# Altium project PCB_3U_DAC.PrjPCB (part 3 of 3)
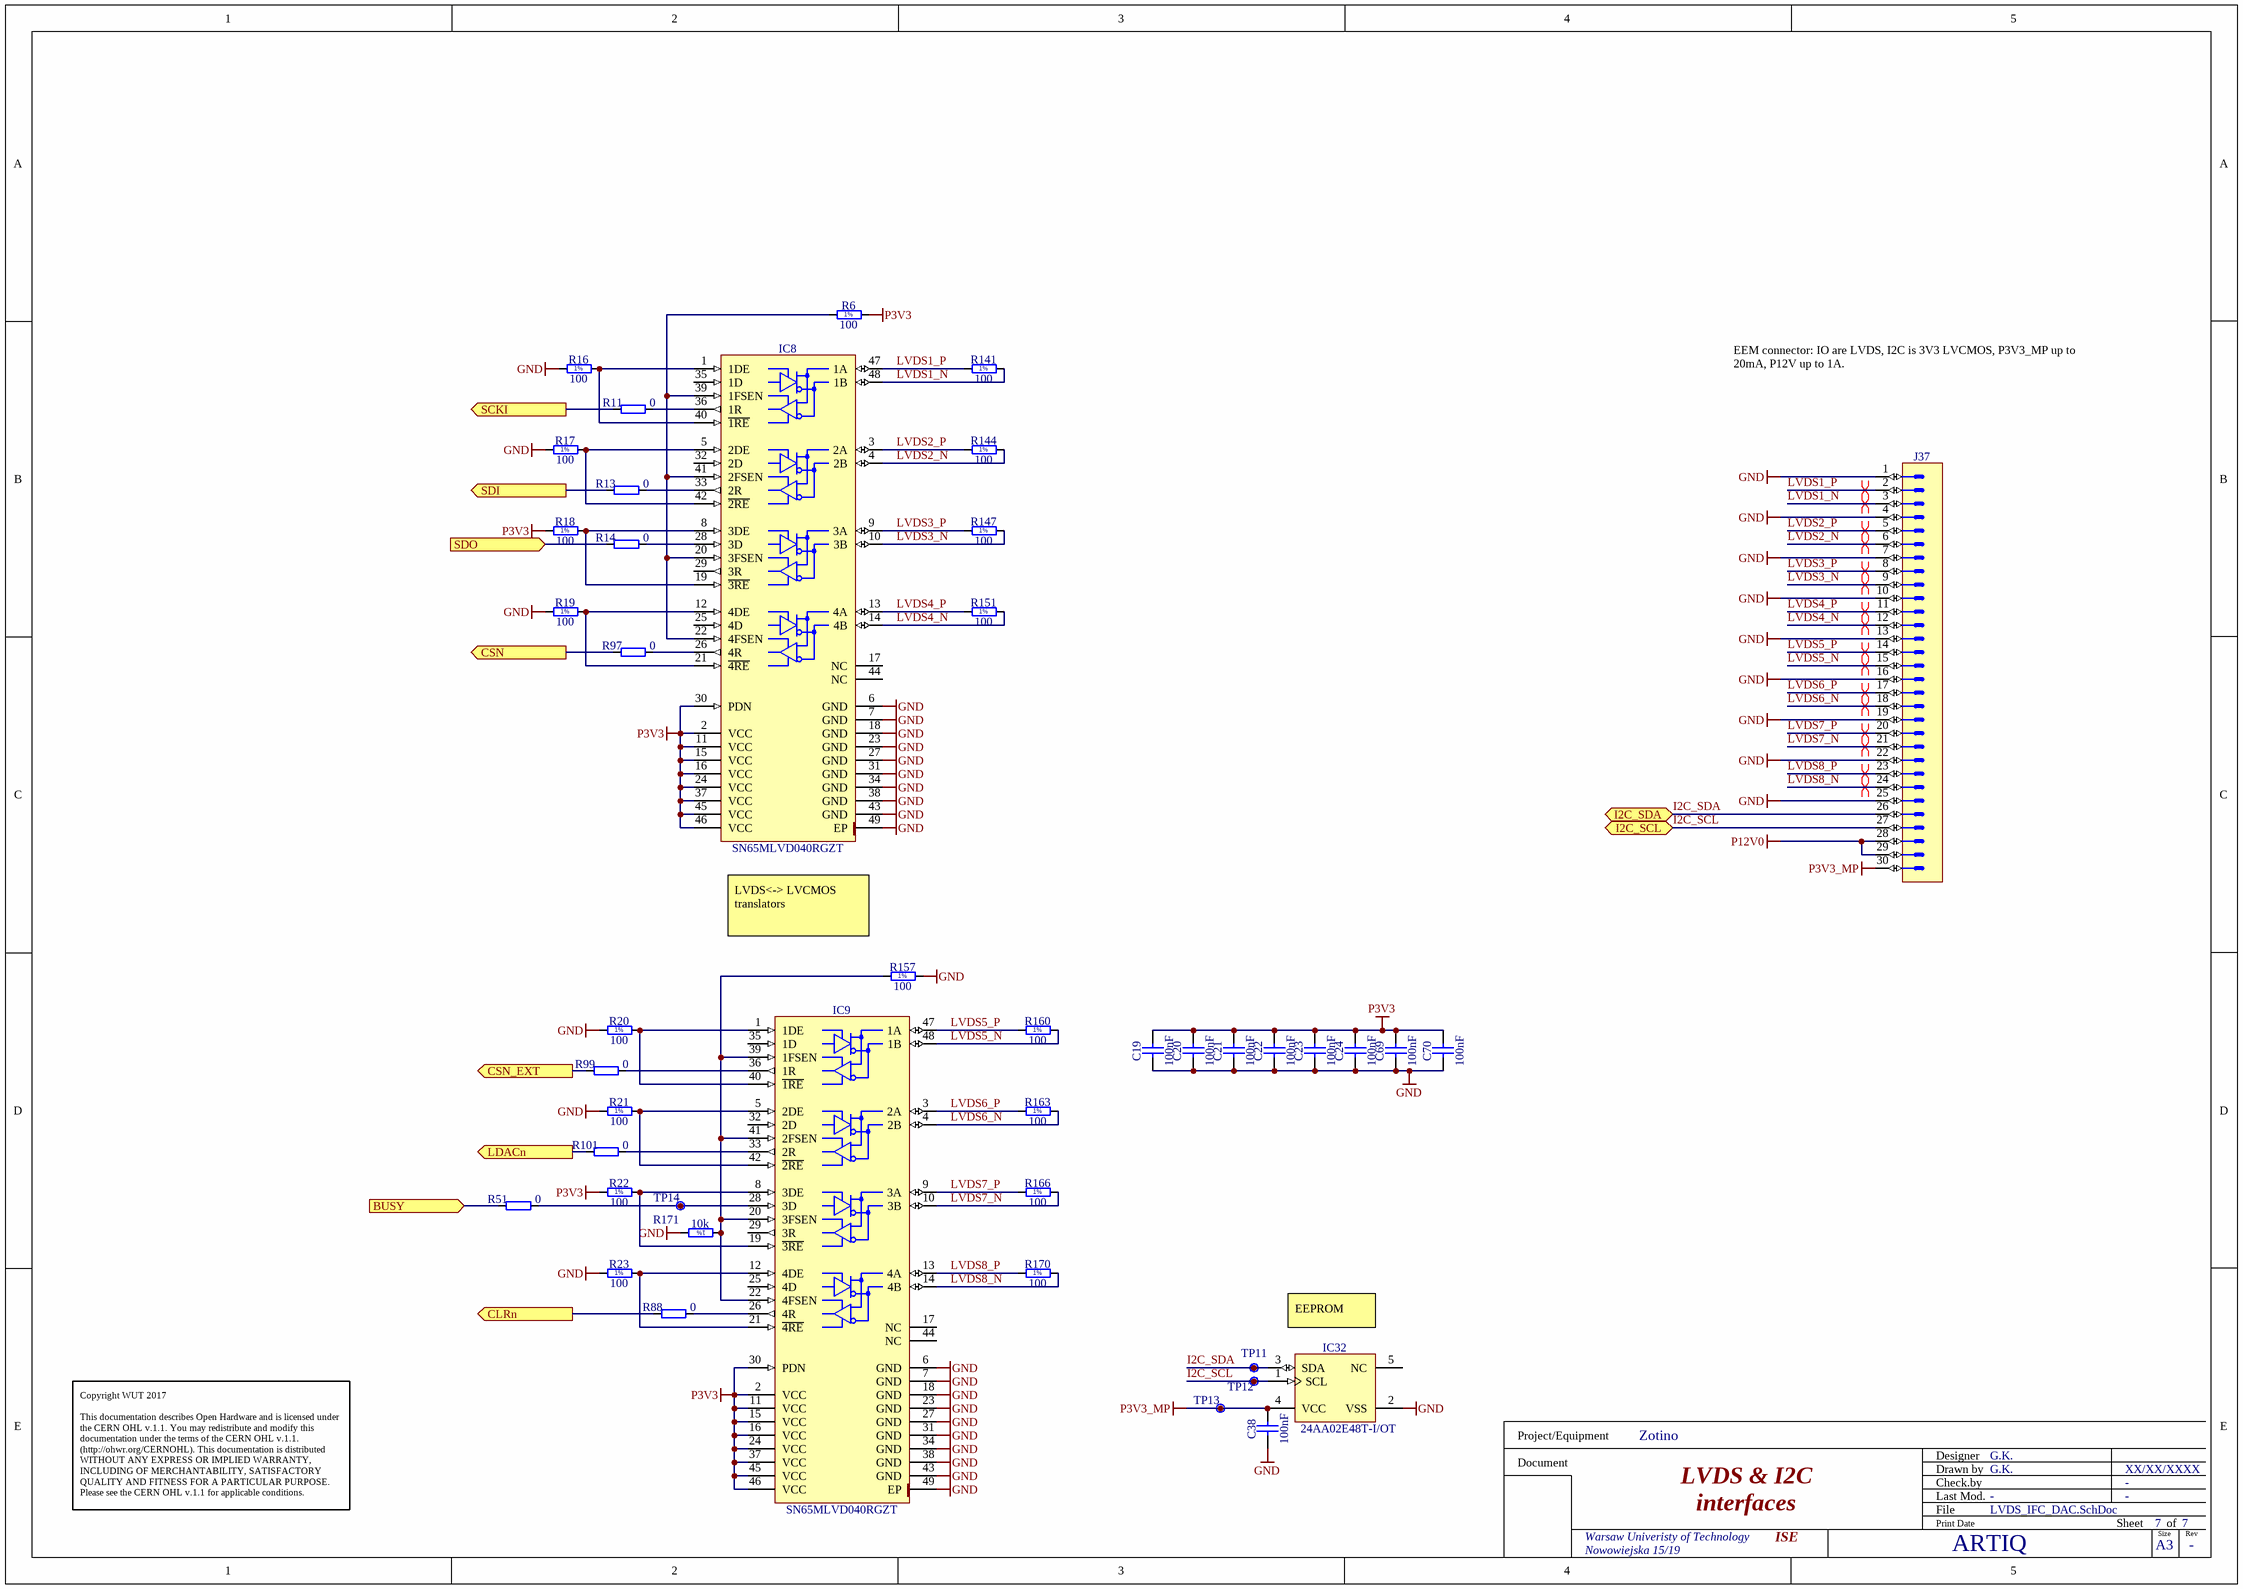
[diagram p6: LVDS_IFC_DAC.SchDoc]

## Nets that join several sheets
GND: PCB_3U_DAC (79 pins), Supply_DAC (43 pins), U_Output_channel1 (8 pins), U_Output_channel2 (8 pins), U_Output_channel3 (8 pins), U_Output_channel4 (8 pins), U_Output_channel5 (8 pins), U_Output_channel6 (8 pins), U_Output_channel7 (8 pins), U_Output_channel8 (8 pins), U_Output_channel9 (8 pins), U_Output_channel10 (8 pins), U_Output_channel11 (8 pins), U_Output_channel12 (8 pins), U_Output_channel13 (8 pins), U_Output_channel14 (8 pins), U_Output_channel15 (8 pins), U_Output_channel16 (8 pins), U_Output_channel17 (8 pins), U_Output_channel18 (8 pins), U_Output_channel19 (8 pins), U_Output_channel20 (8 pins), U_Output_channel21 (8 pins), U_Output_channel22 (8 pins), U_Output_channel23 (8 pins), U_Output_channel24 (8 pins), U_Output_channel25 (8 pins), U_Output_channel26 (8 pins), U_Output_channel27 (8 pins), U_Output_channel28 (8 pins), U_Output_channel29 (8 pins), U_Output_channel30 (8 pins), U_Output_channel31 (8 pins), U_Output_channel32 (8 pins), DAC_32CH (29 pins), LVDS_IFC_DAC (47 pins)
N12V0A: Supply_DAC (7 pins), U_Output_channel1 (C92_1.2 C93_1.2 D5_1.1 IC2_1.4), U_Output_channel2 (C92_2.2 C93_2.2 D5_2.1 IC2_2.4), U_Output_channel3 (C92_3.2 C93_3.2 D5_3.1 IC2_3.4), U_Output_channel4 (C92_4.2 C93_4.2 D5_4.1 IC2_4.4), U_Output_channel5 (C92_5.2 C93_5.2 D5_5.1 IC2_5.4), U_Output_channel6 (C92_6.2 C93_6.2 D5_6.1 IC2_6.4), U_Output_channel7 (C92_7.2 C93_7.2 D5_7.1 IC2_7.4), U_Output_channel8 (C92_8.2 C93_8.2 D5_8.1 IC2_8.4), U_Output_channel9 (C92_9.2 C93_9.2 D5_9.1 IC2_9.4), U_Output_channel10 (C92_10.2 C93_10.2 D5_10.1 IC2_10.4), U_Output_channel11 (C92_11.2 C93_11.2 D5_11.1 IC2_11.4), U_Output_channel12 (C92_12.2 C93_12.2 D5_12.1 IC2_12.4), U_Output_channel13 (C92_13.2 C93_13.2 D5_13.1 IC2_13.4), U_Output_channel14 (C92_14.2 C93_14.2 D5_14.1 IC2_14.4), U_Output_channel15 (C92_15.2 C93_15.2 D5_15.1 IC2_15.4), U_Output_channel16 (C92_16.2 C93_16.2 D5_16.1 IC2_16.4), U_Output_channel17 (C92_17.2 C93_17.2 D5_17.1 IC2_17.4), U_Output_channel18 (C92_18.2 C93_18.2 D5_18.1 IC2_18.4), U_Output_channel19 (C92_19.2 C93_19.2 D5_19.1 IC2_19.4), U_Output_channel20 (C92_20.2 C93_20.2 D5_20.1 IC2_20.4), U_Output_channel21 (C92_21.2 C93_21.2 D5_21.1 IC2_21.4), U_Output_channel22 (C92_22.2 C93_22.2 D5_22.1 IC2_22.4), U_Output_channel23 (C92_23.2 C93_23.2 D5_23.1 IC2_23.4), U_Output_channel24 (C92_24.2 C93_24.2 D5_24.1 IC2_24.4), U_Output_channel25 (C92_25.2 C93_25.2 D5_25.1 IC2_25.4), U_Output_channel26 (C92_26.2 C93_26.2 D5_26.1 IC2_26.4), U_Output_channel27 (C92_27.2 C93_27.2 D5_27.1 IC2_27.4), U_Output_channel28 (C92_28.2 C93_28.2 D5_28.1 IC2_28.4), U_Output_channel29 (C92_29.2 C93_29.2 D5_29.1 IC2_29.4), U_Output_channel30 (C92_30.2 C93_30.2 D5_30.1 IC2_30.4), U_Output_channel31 (C92_31.2 C93_31.2 D5_31.1 IC2_31.4), U_Output_channel32 (C92_32.2 C93_32.2 D5_32.1 IC2_32.4), DAC_32CH (5 pins)
N13V0_SCSI: PCB_3U_DAC (5 pins), Supply_DAC (F2.1)
P3V3: PCB_3U_DAC (C96.2 IC19.4 IC23.10 IC23.16), Supply_DAC (7 pins), DAC_32CH (L1.1), LVDS_IFC_DAC (29 pins)
P3V3_MP: PCB_3U_DAC (J2.10), LVDS_IFC_DAC (C38.2 IC32.4 J37.30 TP13.1)
P12V0: PCB_3U_DAC (J2.7), Supply_DAC (C10.1 C129.2 L8.2), LVDS_IFC_DAC (J37.28 J37.29)
P12V0A: Supply_DAC (7 pins), U_Output_channel1 (C90_1.1 C91_1.2 D5_1.2 IC2_1.7), U_Output_channel2 (C90_2.1 C91_2.2 D5_2.2 IC2_2.7), U_Output_channel3 (C90_3.1 C91_3.2 D5_3.2 IC2_3.7), U_Output_channel4 (C90_4.1 C91_4.2 D5_4.2 IC2_4.7), U_Output_channel5 (C90_5.1 C91_5.2 D5_5.2 IC2_5.7), U_Output_channel6 (C90_6.1 C91_6.2 D5_6.2 IC2_6.7), U_Output_channel7 (C90_7.1 C91_7.2 D5_7.2 IC2_7.7), U_Output_channel8 (C90_8.1 C91_8.2 D5_8.2 IC2_8.7), U_Output_channel9 (C90_9.1 C91_9.2 D5_9.2 IC2_9.7), U_Output_channel10 (C90_10.1 C91_10.2 D5_10.2 IC2_10.7), U_Output_channel11 (C90_11.1 C91_11.2 D5_11.2 IC2_11.7), U_Output_channel12 (C90_12.1 C91_12.2 D5_12.2 IC2_12.7), U_Output_channel13 (C90_13.1 C91_13.2 D5_13.2 IC2_13.7), U_Output_channel14 (C90_14.1 C91_14.2 D5_14.2 IC2_14.7), U_Output_channel15 (C90_15.1 C91_15.2 D5_15.2 IC2_15.7), U_Output_channel16 (C90_16.1 C91_16.2 D5_16.2 IC2_16.7), U_Output_channel17 (C90_17.1 C91_17.2 D5_17.2 IC2_17.7), U_Output_channel18 (C90_18.1 C91_18.2 D5_18.2 IC2_18.7), U_Output_channel19 (C90_19.1 C91_19.2 D5_19.2 IC2_19.7), U_Output_channel20 (C90_20.1 C91_20.2 D5_20.2 IC2_20.7), U_Output_channel21 (C90_21.1 C91_21.2 D5_21.2 IC2_21.7), U_Output_channel22 (C90_22.1 C91_22.2 D5_22.2 IC2_22.7), U_Output_channel23 (C90_23.1 C91_23.2 D5_23.2 IC2_23.7), U_Output_channel24 (C90_24.1 C91_24.2 D5_24.2 IC2_24.7), U_Output_channel25 (C90_25.1 C91_25.2 D5_25.2 IC2_25.7), U_Output_channel26 (C90_26.1 C91_26.2 D5_26.2 IC2_26.7), U_Output_channel27 (C90_27.1 C91_27.2 D5_27.2 IC2_27.7), U_Output_channel28 (C90_28.1 C91_28.2 D5_28.2 IC2_28.7), U_Output_channel29 (C90_29.1 C91_29.2 D5_29.2 IC2_29.7), U_Output_channel30 (C90_30.1 C91_30.2 D5_30.2 IC2_30.7), U_Output_channel31 (C90_31.1 C91_31.2 D5_31.2 IC2_31.7), U_Output_channel32 (C90_32.1 C91_32.2 D5_32.2 IC2_32.7), DAC_32CH (6 pins)
P13V0_SCSI: PCB_3U_DAC (5 pins), Supply_DAC (F1.1)
CSN_EXT: PCB_3U_DAC (IC23.12 R118.2), LVDS_IFC_DAC (R99.1)
DAC_OUT_N1: PCB_3U_DAC (J1.35 J3.2), U_Output_channel1 (L4_1.3)
DAC_OUT_N2: PCB_3U_DAC (J1.36 J3.5), U_Output_channel2 (L4_2.3)
DAC_OUT_N3: PCB_3U_DAC (J1.37 J3.8), U_Output_channel3 (L4_3.3)
DAC_OUT_N4: PCB_3U_DAC (J1.38 J3.11), U_Output_channel4 (L4_4.3)
DAC_OUT_N5: PCB_3U_DAC (J1.39 J3.14), U_Output_channel5 (L4_5.3)
DAC_OUT_N6: PCB_3U_DAC (J1.40 J3.17), U_Output_channel6 (L4_6.3)
DAC_OUT_N7: PCB_3U_DAC (J1.41 J3.20), U_Output_channel7 (L4_7.3)
DAC_OUT_N8: PCB_3U_DAC (J1.42 J3.23), U_Output_channel8 (L4_8.3)
DAC_OUT_N9: PCB_3U_DAC (J1.43 J4.2), U_Output_channel9 (L4_9.3)
DAC_OUT_N10: PCB_3U_DAC (J1.44 J4.5), U_Output_channel10 (L4_10.3)
DAC_OUT_N11: PCB_3U_DAC (J1.45 J4.8), U_Output_channel11 (L4_11.3)
DAC_OUT_N12: PCB_3U_DAC (J1.46 J4.11), U_Output_channel12 (L4_12.3)
DAC_OUT_N13: PCB_3U_DAC (J1.47 J4.14), U_Output_channel13 (L4_13.3)
DAC_OUT_N14: PCB_3U_DAC (J1.48 J4.17), U_Output_channel14 (L4_14.3)
DAC_OUT_N15: PCB_3U_DAC (J1.49 J4.20), U_Output_channel15 (L4_15.3)
DAC_OUT_N16: PCB_3U_DAC (J1.50 J4.23), U_Output_channel16 (L4_16.3)
DAC_OUT_N17: PCB_3U_DAC (J1.53 J5.2), U_Output_channel17 (L4_17.3)
DAC_OUT_N18: PCB_3U_DAC (J1.54 J5.5), U_Output_channel18 (L4_18.3)
DAC_OUT_N19: PCB_3U_DAC (J1.55 J5.8), U_Output_channel19 (L4_19.3)
DAC_OUT_N20: PCB_3U_DAC (J1.56 J5.11), U_Output_channel20 (L4_20.3)
DAC_OUT_N21: PCB_3U_DAC (J1.57 J5.14), U_Output_channel21 (L4_21.3)
DAC_OUT_N22: PCB_3U_DAC (J1.58 J5.17), U_Output_channel22 (L4_22.3)
DAC_OUT_N23: PCB_3U_DAC (J1.59 J5.20), U_Output_channel23 (L4_23.3)
DAC_OUT_N24: PCB_3U_DAC (J1.60 J5.23), U_Output_channel24 (L4_24.3)
DAC_OUT_N25: PCB_3U_DAC (J1.61 J7.2), U_Output_channel25 (L4_25.3)
DAC_OUT_N26: PCB_3U_DAC (J1.62 J7.5), U_Output_channel26 (L4_26.3)
DAC_OUT_N27: PCB_3U_DAC (J1.63 J7.8), U_Output_channel27 (L4_27.3)
DAC_OUT_N28: PCB_3U_DAC (J1.64 J7.11), U_Output_channel28 (L4_28.3)
DAC_OUT_N29: PCB_3U_DAC (J1.65 J7.14), U_Output_channel29 (L4_29.3)
DAC_OUT_N30: PCB_3U_DAC (J1.66 J7.17), U_Output_channel30 (L4_30.3)
DAC_OUT_N31: PCB_3U_DAC (J1.67 J7.20), U_Output_channel31 (L4_31.3)
DAC_OUT_N32: PCB_3U_DAC (J1.68 J7.23), U_Output_channel32 (L4_32.3)
DAC_OUT_P1: PCB_3U_DAC (J1.1 J3.1), U_Output_channel1 (L4_1.4)
DAC_OUT_P2: PCB_3U_DAC (J1.2 J3.4), U_Output_channel2 (L4_2.4)
DAC_OUT_P3: PCB_3U_DAC (J1.3 J3.7), U_Output_channel3 (L4_3.4)
DAC_OUT_P4: PCB_3U_DAC (J1.4 J3.10), U_Output_channel4 (L4_4.4)
DAC_OUT_P5: PCB_3U_DAC (J1.5 J3.13), U_Output_channel5 (L4_5.4)
DAC_OUT_P6: PCB_3U_DAC (J1.6 J3.16), U_Output_channel6 (L4_6.4)
DAC_OUT_P7: PCB_3U_DAC (J1.7 J3.19), U_Output_channel7 (L4_7.4)
DAC_OUT_P8: PCB_3U_DAC (J1.8 J3.22), U_Output_channel8 (L4_8.4)
DAC_OUT_P9: PCB_3U_DAC (J1.9 J4.1), U_Output_channel9 (L4_9.4)
DAC_OUT_P10: PCB_3U_DAC (J1.10 J4.4), U_Output_channel10 (L4_10.4)
DAC_OUT_P11: PCB_3U_DAC (J1.11 J4.7), U_Output_channel11 (L4_11.4)
DAC_OUT_P12: PCB_3U_DAC (J1.12 J4.10), U_Output_channel12 (L4_12.4)
DAC_OUT_P13: PCB_3U_DAC (J1.13 J4.13), U_Output_channel13 (L4_13.4)
DAC_OUT_P14: PCB_3U_DAC (J1.14 J4.16), U_Output_channel14 (L4_14.4)
DAC_OUT_P15: PCB_3U_DAC (J1.15 J4.19), U_Output_channel15 (L4_15.4)
DAC_OUT_P16: PCB_3U_DAC (J1.16 J4.22), U_Output_channel16 (L4_16.4)
DAC_OUT_P17: PCB_3U_DAC (J1.19 J5.1), U_Output_channel17 (L4_17.4)
DAC_OUT_P18: PCB_3U_DAC (J1.20 J5.4), U_Output_channel18 (L4_18.4)
DAC_OUT_P19: PCB_3U_DAC (J1.21 J5.7), U_Output_channel19 (L4_19.4)
DAC_OUT_P20: PCB_3U_DAC (J1.22 J5.10), U_Output_channel20 (L4_20.4)
DAC_OUT_P21: PCB_3U_DAC (J1.23 J5.13), U_Output_channel21 (L4_21.4)
DAC_OUT_P22: PCB_3U_DAC (J1.24 J5.16), U_Output_channel22 (L4_22.4)
DAC_OUT_P23: PCB_3U_DAC (J1.25 J5.19), U_Output_channel23 (L4_23.4)
DAC_OUT_P24: PCB_3U_DAC (J1.26 J5.22), U_Output_channel24 (L4_24.4)
DAC_OUT_P25: PCB_3U_DAC (J1.27 J7.1), U_Output_channel25 (L4_25.4)
DAC_OUT_P26: PCB_3U_DAC (J1.28 J7.4), U_Output_channel26 (L4_26.4)
DAC_OUT_P27: PCB_3U_DAC (J1.29 J7.7), U_Output_channel27 (L4_27.4)
DAC_OUT_P28: PCB_3U_DAC (J1.30 J7.10), U_Output_channel28 (L4_28.4)
DAC_OUT_P29: PCB_3U_DAC (J1.31 J7.13), U_Output_channel29 (L4_29.4)
DAC_OUT_P30: PCB_3U_DAC (J1.32 J7.16), U_Output_channel30 (L4_30.4)
DAC_OUT_P31: PCB_3U_DAC (J1.33 J7.19), U_Output_channel31 (L4_31.4)
DAC_OUT_P32: PCB_3U_DAC (J1.34 J7.22), U_Output_channel32 (L4_32.4)
I2C_SCL: PCB_3U_DAC (J2.12), LVDS_IFC_DAC (IC32.1 J37.27 TP12.1)
I2C_SDA: PCB_3U_DAC (J2.11), LVDS_IFC_DAC (IC32.3 J37.26 TP11.1)
NetIC18_1: PCB_3U_DAC (IC19.2), DAC_32CH (IC18.1 TP16.1)
NetIC18_2: DAC_32CH (IC18.2), LVDS_IFC_DAC (R51.1)
NetIC18_53: DAC_32CH (IC18.53 TP4.1), LVDS_IFC_DAC (R97.1)
NetIC18_56: DAC_32CH (IC18.56 TP3.1), LVDS_IFC_DAC (R14.1)
NetIC18_63: DAC_32CH (IC18.63 TP17.1), LVDS_IFC_DAC (R101.1)
NetIC18_64: DAC_32CH (IC18.64 TP15.1), LVDS_IFC_DAC (R88.1)
SCKI: PCB_3U_DAC (IC23.11 R117.2), DAC_32CH (IC18.54 R82.2 TP1.1), LVDS_IFC_DAC (R11.1)
SDI: PCB_3U_DAC (IC23.14 R116.2), DAC_32CH (IC18.55 R58.2 TP2.1), LVDS_IFC_DAC (R13.1)
VOUT1: U_Output_channel1 (R24_1.1), DAC_32CH (IC18.42)
VOUT2: U_Output_channel2 (R24_2.1), DAC_32CH (IC18.43)
VOUT3: U_Output_channel3 (R24_3.1), DAC_32CH (IC18.44)
VOUT4: U_Output_channel4 (R24_4.1), DAC_32CH (IC18.45)
VOUT5: U_Output_channel5 (R24_5.1), DAC_32CH (IC18.47)
VOUT6: U_Output_channel6 (R24_6.1), DAC_32CH (IC18.48)
VOUT7: U_Output_channel7 (R24_7.1), DAC_32CH (IC18.49)
VOUT8: U_Output_channel8 (R24_8.1), DAC_32CH (IC18.50)
VOUT9: U_Output_channel9 (R24_9.1), DAC_32CH (IC18.21)
VOUT10: U_Output_channel10 (R24_10.1), DAC_32CH (IC18.22)
VOUT11: U_Output_channel11 (R24_11.1), DAC_32CH (IC18.23)
VOUT12: U_Output_channel12 (R24_12.1), DAC_32CH (IC18.24)
VOUT13: U_Output_channel13 (R24_13.1), DAC_32CH (IC18.26)
VOUT14: U_Output_channel14 (R24_14.1), DAC_32CH (IC18.27)
VOUT15: U_Output_channel15 (R24_15.1), DAC_32CH (IC18.28)
VOUT16: U_Output_channel16 (R24_16.1), DAC_32CH (IC18.29)
VOUT17: U_Output_channel17 (R24_17.1), DAC_32CH (IC18.30)
VOUT18: U_Output_channel18 (R24_18.1), DAC_32CH (IC18.31)
VOUT19: U_Output_channel19 (R24_19.1), DAC_32CH (IC18.32)
VOUT20: U_Output_channel20 (R24_20.1), DAC_32CH (IC18.33)
VOUT21: U_Output_channel21 (R24_21.1), DAC_32CH (IC18.37)
VOUT22: U_Output_channel22 (R24_22.1), DAC_32CH (IC18.38)
VOUT23: U_Output_channel23 (R24_23.1), DAC_32CH (IC18.39)
VOUT24: U_Output_channel24 (R24_24.1), DAC_32CH (IC18.40)
VOUT25: U_Output_channel25 (R24_25.1), DAC_32CH (IC18.60)
VOUT26: U_Output_channel26 (R24_26.1), DAC_32CH (IC18.61)
VOUT27: U_Output_channel27 (R24_27.1), DAC_32CH (IC18.62)
VOUT28: U_Output_channel28 (R24_28.1), DAC_32CH (IC18.3)
VOUT29: U_Output_channel29 (R24_29.1), DAC_32CH (IC18.5)
VOUT30: U_Output_channel30 (R24_30.1), DAC_32CH (IC18.6)
VOUT31: U_Output_channel31 (R24_31.1), DAC_32CH (IC18.7)
VOUT32: U_Output_channel32 (R24_32.1), DAC_32CH (IC18.8)